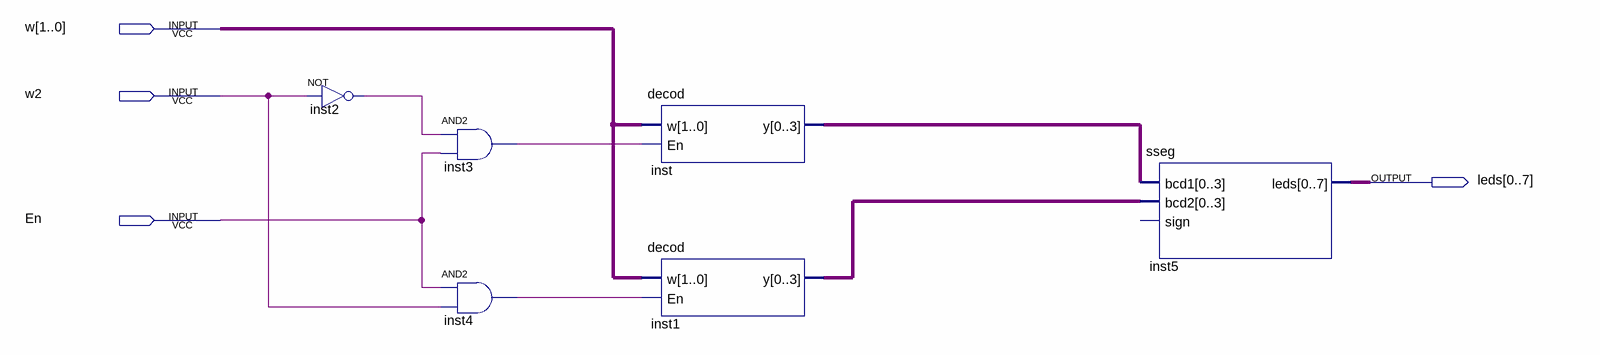
[diagram p0: schematic sheet]
// Quartus schematic decodModified.bdf as structural Verilog: 6 symbols, 4 pins
module decodModified (
  input  [1:0] w,
  input  w2,
  input  En,
  output [0:7] leds
);

  wire inst2_out, inst3_out, inst4_out;
  wire [3:0] inst1_y, inst_y;

  not inst2 (inst2_out, w2);
  and inst3 (inst3_out, inst2_out, En);
  and inst4 (inst4_out, En, w2);
  decod inst (.w(w), .En(inst3_out), .y(inst_y));
  decod inst1 (.w(w), .En(inst4_out), .y(inst1_y));
  sseg inst5 (.bcd1(inst_y), .bcd2(inst1_y), .leds(leds));  // open: sign
endmodule
